# Altium project Arduino_Shield_Project_SUMM23.PrjPcb
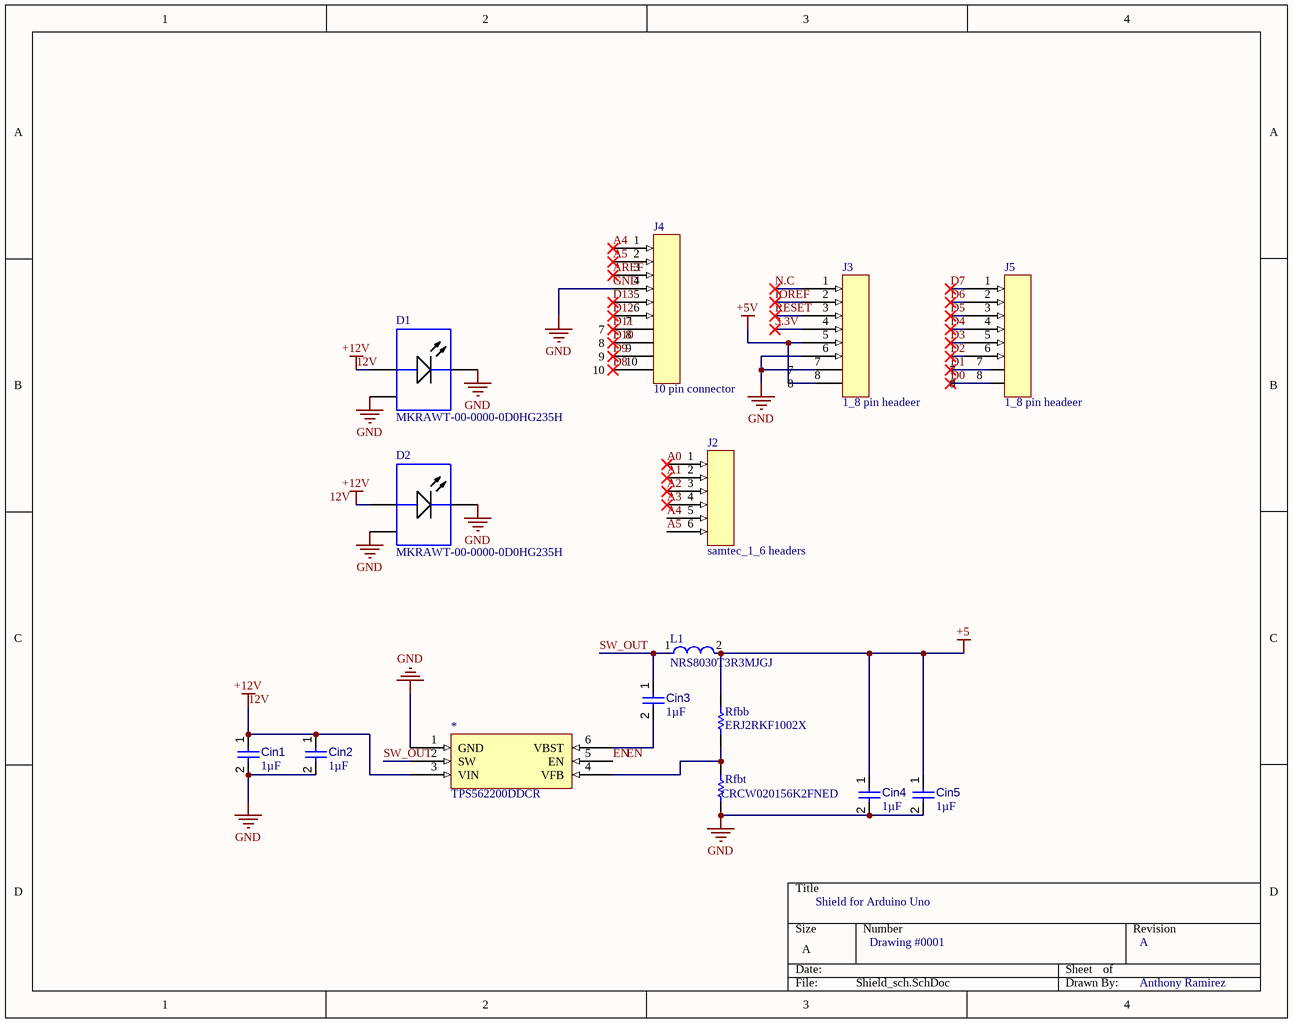
[diagram p0: Shield_sch.SchDoc]
1 sheet, 15 parts. Net scope: global (net labels, ports and power ports of the same name join across sheets).
Board file: arduino shield.PcbDoc

## Sheet Shield_sch.SchDoc
size A; SheetNumber: 1; SheetTotal: 1

### Parts
*  TPS562200DDCR  [SOT95P245X110-6N]
Cin1  value 1µF  [CAPC1608X90X40LL10T20]  (hidden comment: Capacitor 1 uF +/- 10% 25 V 0603)
Cin2  value 1µF  [CAPC1608X90X40LL10T20]  (hidden comment: Capacitor 1 uF +/- 10% 25 V 0603)
Cin3  value 1µF  [CAPC1608X90X40LL10T20]  (hidden comment: Capacitor 1 uF +/- 10% 25 V 0603)
Cin4  value 1µF  [CAPC1608X90X40LL10T20]  (hidden comment: Capacitor 1 uF +/- 10% 25 V 0603)
Cin5  value 1µF  [CAPC1608X90X40LL10T20]  (hidden comment: Capacitor 1 uF +/- 10% 25 V 0603)
D1  MKRAWT-00-0000-0D0HG235H  [CREE-MK-R-2_V]
D2  MKRAWT-00-0000-0D0HG235H  [CREE-MK-R-2_V]
J2  samtec_1_6 headers  [samtec_1_6 headers-Footprint-1]
J3  1_8 pin headeer  [1_8_Pin headers-Footprint-1]
J4  10 pin connector  [10 pin connector-Footprint-1]
J5  1_8 pin headeer  [1_8_Pin headers-Footprint-1]
L1  NRS8030T3R3MJGJ  [FP-NRS8030-MFG]
Rfbb  ERJ2RKF1002X  [RESC1005X40X25LL05T05]
Rfbt  CRCW020156K2FNED  [RESC0603X28X15NL05T05]

### Nets
12V: *.3(VIN) Cin1.1 Cin2.1 D1.1(A) D2.1(A)  [also labelled +12V]
+5: Cin4.1 Cin5.1 L1.2 Rfbb.1
+5V: J3.5
GND: *.1(GND) Cin1.2 Cin2.2 Cin4.2 Cin5.2 D1.2(K) D1.3(EP) D2.2(K) D2.3(EP) J3.6 J4.4 Rfbt.2
3.3V: J3.4
A0: J2.1
A1: J2.2
A2: J2.3
A3: J2.4
A4: J2.5 J4.1
A5: J2.6 J4.2
AREF: J4.3
D2: J5.6
D3: J5.5
D4: J5.4
D5: J5.3
D6: J5.2
D7: J5.1
D12: J4.6
D13: J4.5
EN: *.5(EN)
IOREF: J3.2
N.C: J3.1
RESET: J3.3
SW_OUT: *.2(SW) Cin3.1 L1.1
Net*_4: *.4(VFB) Rfbb.2 Rfbt.1
Net*_6: *.6(VBST) Cin3.2

Not connected (* = marked no-connect by the designer): J3 7 8; J4 7 8 9 10; J5 7 8

### Notes on the sheet
- Shield for Arduino Uno
- Drawing #0001
- A
- Anthony Ramirez
- Labels drawn without touching a wire or pin: 12V, D8, D9, D10, D11, EN

### Library data of the parts
* = CMP-019-00051-1: Switching Regulator, 2A, 650kHz Switching Freq-Max, PDSO6; Control Technique: PULSE WIDTH MODULATION; Nominal Input Voltage: 12V; Switcher Configuration: BUCK; Package Body Material: Plastic; Max Input Voltage: 17V; Max Output Current: 4.3A; Min Input Voltage: 4.5V; Number of Functions: 1; Moisture Sensitivity Level: 1; Width: 1.6mm; Min Operating Temperature: -40°C; JESD-609 Code: e3; Temperature Grade: INDUSTRIAL; Package Code: TSSOP; Surface Mount: Yes; Max Operating Temperature: 85°C; Switching Frequency-Max: 650kHz; Height - Seated (Max): 1.1mm; Terminal Finish: Tin; Package Style: SMALL OUTLINE, THIN PROFILE, SHRINK PITCHMeter; Analog IC - Other Type: SWITCHING REGULATOR; Length: 2.9mm; Terminal Pitch: 0.95mm; Number of Pins: 6; JESD-30 Code: R-PDSO-G6; Reach SVHC Compliant: Yes; Peak Reflow Temperature (Cel): 260°C; RoHS Compliant: Yes; Terminal Position: DUAL; Package Shape: Rectangular; Terminal Form: Gull Wing
Cin1-Cin5 = CMP-001-00005-6: Chip Capacitor, 1 uF, +/- 10%, 25 V, 0603 (1608 Metric); Capacitor Type: Ceramic; Voltage Rating: 25V; Pins: 2; Mounting Technology: SM; RoHS Compliant: True; Max Operating Temperature: 125°C; Case/Package: 0603; Min Operating Temperature: -55°C; Tolerance: 10%
D1 D2 = CMP-2100-00977-1: LED, White, 12 V, 2-Pin SMD, RoHS, Tape and Reel
J2 = CMP-002-00071-1: 1 row 6 pin headers with 1.27mm radius for arduino shield
J3 J5 = 1_8pin_headers-1: Board Connector, 8 Contact(s), 1 Row(s), Female, 0.049 inch Pitch, Crimp Terminal, Locking, Receptacle; Mating Contact Row Spacing: 0.118inch; Contact Style: SQ PIN-SKT; PCB Contact Pattern: RECTANGULAR; Dielectric Withstanding Voltage (AC): 1.5kV; Mixed Contacts: No; Body Depth: 0.156inch; Durability: 25Cycles; Reliability: COMMERCIAL; Body Length: 0.463inch; Number of Rows Loaded: 1; Insulation Resistance: 100MR; PCB Contact Row Spacing: 4.6228mm; Reference Standard: UL; Rated Current (Signal): 5A; Additional Feature: ROHS COMPLIANT; Number Of PCB Rows: 2; Number of Contacts: 8; Option: General Purpose; Polarization Key: POLARIZED HOUSING; Contact Resistance: 20mR; Body Breadth: 0.126inch; Mating Information: MULTIPLE MATING PARTS AVAILABLE; Board Mounting Option: PEG; Flammability Rating: UL94 V-0; Mating Contact Pitch: 0.049inch; Termination: Crimp; RoHS Compliant: Yes; Min Operating Temperature: -40°C; MIL Conformance: No; Max Operating Temperature: 85°C; Insulation Color: Black; Mount: Board; Contact Finish - Mating: NOT SPECIFIED; IEC Conformance: No; Body/Shell Style: RECEPTACLE; Mounting Style: STRAIGHT; JESD-609 Code: e3; Contact Gender: Female; Terminal Pitch: 1.25mm; DIN Conformance: No; Reach SVHC Compliant: Yes; Filter Feature: No; Insulation Material: Polyester; Contact Finish - Termination: Tin (Sn); Contact Pattern: RECTANGULAR; Mounting Option 1: LOCKING; Connector Type: BOARD CONNECTOR; Number Of Connectors: 1; Contact Material: Copper Alloy
J4 = CMP-002-00074-1: 10pin connector; Connector Type: BOARD CONNECTOR; RoHS Compliant: Yes; Min Operating Temperature: -40°C; Max Operating Temperature: 85°C
L1 = CMP-14484-000405-1: Inductor Power Shielded Wirewound 3.3uH 20% 100KHz Ferrite 4.2A 24.7mΩ DCR T/R; Current Rating: 4.3A; DC Resistance (DCR): 19mR; Self Resonant Frequency: 50MHz; Height: 3mm; Lead Free: Lead Free; Saturation Current: 4.2A; Termination: SMD/SMT; RoHS Compliant: Yes; Resistor Type: Wirewound; RMS Current (Irms): 4.3A; Series: NRS; Halogen Free: Halogen Free; Shielding: Shielded; Length: 8mm; Max DC Current: 4.2A; Height - Seated (Max): 0.118inch; Radiation Hardening: No; Min Operating Temperature: -25°C; Number of Pins: 2; Core Material: Ferrite; Inductance: 3.3uH; Package Quantity: 1000; REACH SVHC: No SVHC; Test Frequency: 100kHz; Tolerance: 20%; Case/Package: Nonstandard; Inductance Tolerance: 20%; Width: 0.315inch; Mount: Surface Mount; Depth: 8.2mm; Lead Pitch: 5.6mm; Packaging: Tape and Reel; Max Operating Temperature: 125°C
Rfbb = CMP-2000-07588-1: Chip Resistor, 10 KOhm, +/- 1%, 0.1 W, -55 to 155 degC, 0402 (1005 Metric), RoHS, Tape and Reel; Manufacturer: Panasonic; Power Rating: 100mW; Voltage Rating: 50V; Resistance: 10KOhm; Case\/Package: 0402; Temperature Coefficient: 100ppm\/degreesC; RoHSCompliant: True; Lead Free: LeadFree; Package Quantity: 1; Contact Plating: Tin; Length: 1mm; Radiation Hardening: No; REACH SVHC: NoSVHC; Max Operating Temperature: 155degC; Depth: 0.5mm; Case Code (Imperial): 0402; Military Standard: Not; Package Description: 2-Pin Surface Mount Device, Body 1 x 0.5 mm; Termination: SMD/SMT; Case Code (Metric): 1005; Height: 0.35mm; Packaging: TapeandReel; Voltage Rating (DC): 50V; Package Reference: 402; Number of Pins: 2; Tolerance: 1%; Mounting Technology: SurfaceMount; Width: 0.02inch; Mount: SurfaceMount; Datasheet URL: https://industrial.panasonic.com/cdbs/www-data/pdf/RDA0000/AOA0000C304.pdf; Composition: ThickFilm; Datasheet Version: 02/2017; Manufacturer URL: http://www.panasonic.com/; Max Power Dissipation: 100mW; Number of Terminations: 2; Min Operating Temperature: -55degC
Rfbt = CMP-2004-00723-1: Manufacturer: Vishay Dale; Part Number: CRCW020156K2FNED